# Altium project PCB_Project.PrjPcb
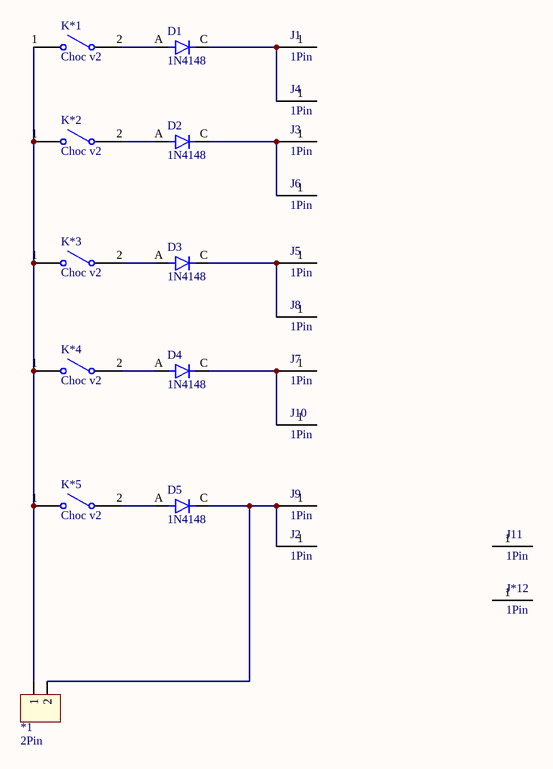
[diagram p0: key.SchDoc]
1 sheet, 23 parts. Net scope: global (net labels, ports and power ports of the same name join across sheets).
Board file: PCB1.PcbDoc

## Sheet key.SchDoc
size A4

### Parts
*1  2Pin  [TH2.54-2pin]
D1  1N4148  [1N4148]
D2  1N4148  [1N4148]
D3  1N4148  [1N4148]
D4  1N4148  [1N4148]
D5  1N4148  [1N4148]
J1  1Pin  [1Pin]
J2  1Pin  [1Pin]
J3  1Pin  [1Pin]
J4  1Pin  [1Pin]
J5  1Pin  [1Pin]
J6  1Pin  [1Pin]
J7  1Pin  [1Pin]
J8  1Pin  [1Pin]
J9  1Pin  [1Pin]
J10  1Pin  [1Pin]
J11  1Pin  [1Pin]
J*12  1Pin  [1Pin]
K*1  Choc v2  [Choco v2]
K*2  Choc v2  [Choco v2]
K*3  Choc v2  [Choco v2]
K*4  Choc v2  [Choco v2]
K*5  Choc v2  [Choco v2]

### Nets
Net*1_1: *1.1 K*1.1 K*2.1 K*3.1 K*4.1 K*5.1
Net*1_2: *1.2 D5.C J2.1 J9.1
NetD1_A: D1.A K*1.2
NetD1_C: D1.C J1.1 J4.1
NetD2_A: D2.A K*2.2
NetD2_C: D2.C J3.1 J6.1
NetD3_A: D3.A K*3.2
NetD3_C: D3.C J5.1 J8.1
NetD4_A: D4.A K*4.2
NetD4_C: D4.C J7.1 J10.1
NetD5_A: D5.A K*5.2

Not connected (* = marked no-connect by the designer): J11 1(0); J*12 1(0)